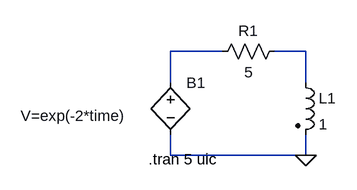
[diagram p0: schematic Task1.asc]
Task1.asc, the LTspice schematic file:
Version 4
SHEET 1 880 680
WIRE 224 64 144 64
WIRE 352 64 304 64
WIRE 144 112 144 64
WIRE 352 112 352 64
WIRE 144 224 144 192
WIRE 352 224 352 192
WIRE 352 224 144 224
FLAG 352 224 0
SYMBOL res 208 80 R270
WINDOW 0 32 56 VTop 2
WINDOW 3 0 56 VBottom 2
SYMATTR InstName R1
SYMATTR Value 5
SYMBOL ind2 336 96 R0
SYMATTR InstName L1
SYMATTR Value 1
SYMATTR Type ind
SYMBOL bv 144 96 R0
WINDOW 3 -231 67 Left 2
SYMATTR InstName B1
SYMATTR Value V=exp(-2*time)
TEXT 110 230 Left 2 !.tran 5 uic

The netlist it stands for:
* Task1.asc
R1 N001 N002 5
L1 N002 0 1
B1 N001 0 V=exp(-2*time)
.tran 5 uic
.backanno
.end